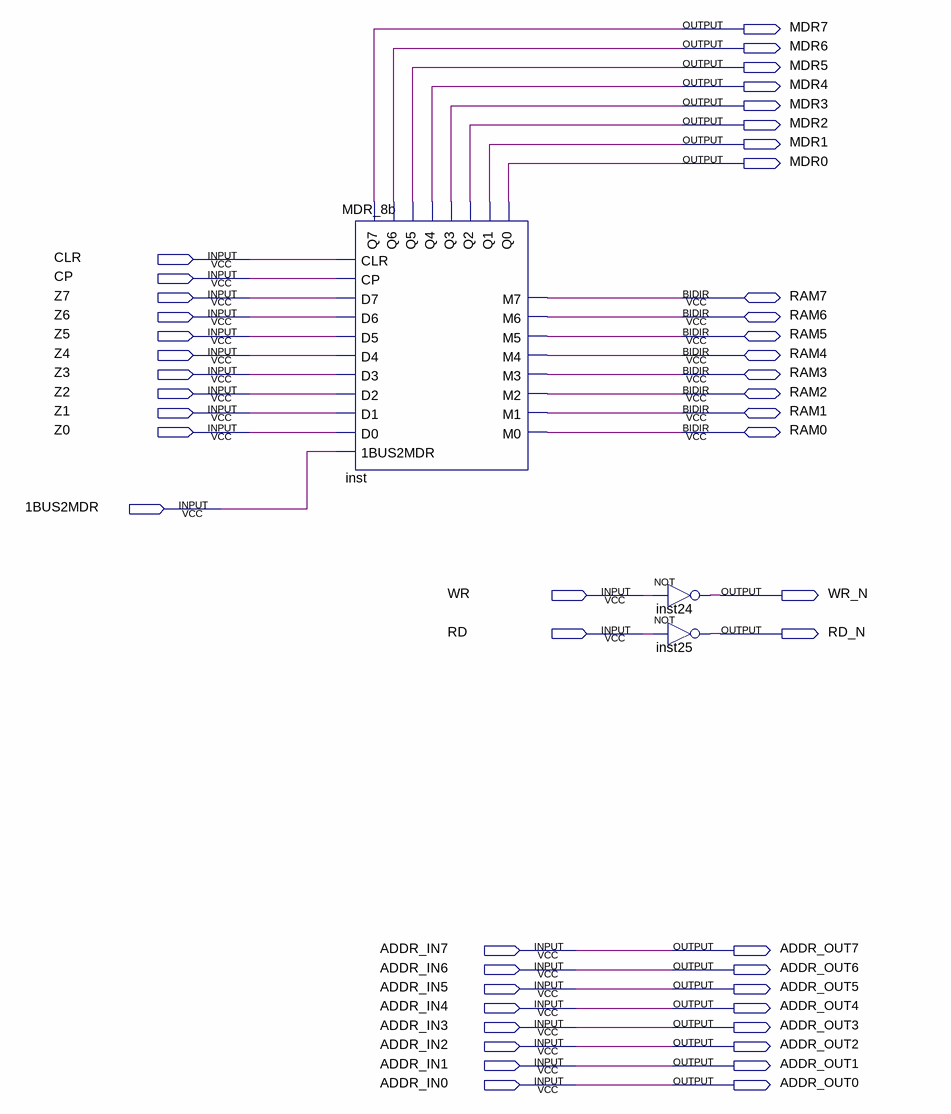
[diagram p0: schematic sheet]
// Quartus schematic test_MDR.bdf as structural Verilog: 3 symbols, 47 pins
module test_MDR (
  input  CLR,
  input  CP,
  input  Z7,
  input  Z6,
  input  Z5,
  input  Z4,
  input  Z3,
  input  Z2,
  input  Z1,
  input  Z0,
  input  \1BUS2MDR ,
  input  WR,
  input  RD,
  input  ADDR_IN7,
  input  ADDR_IN6,
  input  ADDR_IN5,
  input  ADDR_IN4,
  input  ADDR_IN3,
  input  ADDR_IN2,
  input  ADDR_IN1,
  input  ADDR_IN0,
  inout  RAM7,
  inout  RAM6,
  inout  RAM5,
  inout  RAM4,
  inout  RAM3,
  inout  RAM2,
  inout  RAM1,
  inout  RAM0,
  output MDR7,
  output MDR6,
  output MDR5,
  output MDR4,
  output MDR3,
  output MDR2,
  output MDR1,
  output MDR0,
  output WR_N,
  output RD_N,
  output ADDR_OUT7,
  output ADDR_OUT6,
  output ADDR_OUT5,
  output ADDR_OUT4,
  output ADDR_OUT3,
  output ADDR_OUT2,
  output ADDR_OUT1,
  output ADDR_OUT0
);

  MDR_8b inst (
    .CLR(CLR), .CP(CP), .D7(Z7), .D6(Z6), .D5(Z5), .D4(Z4), .D3(Z3), .D2(Z2), .D1(Z1), .D0(Z0),
    .\1BUS2MDR (\1BUS2MDR ), .Q7(MDR7), .Q6(MDR6), .Q5(MDR5), .Q4(MDR4), .Q3(MDR3), .Q2(MDR2), .Q1(MDR1),
    .Q0(MDR0), .M7(RAM7), .M6(RAM6), .M5(RAM5), .M4(RAM4), .M3(RAM3), .M2(RAM2), .M1(RAM1), .M0(RAM0));
  not inst24 (WR_N, WR);
  not inst25 (RD_N, RD);

  assign ADDR_OUT0 = ADDR_IN0;
  assign ADDR_OUT1 = ADDR_IN1;
  assign ADDR_OUT2 = ADDR_IN2;
  assign ADDR_OUT3 = ADDR_IN3;
  assign ADDR_OUT4 = ADDR_IN4;
  assign ADDR_OUT5 = ADDR_IN5;
  assign ADDR_OUT6 = ADDR_IN6;
  assign ADDR_OUT7 = ADDR_IN7;
endmodule
